# Altium schematic sheet HA_Power.SchDoc: Power supply
size A4; Date: 11/21/2016 9:12:52 PM; SheetNumber: 2; PageSetup: Record=PageOptions|CenterHorizontal=True|CenterVertical=True|PrintScale=1.02|XCorrection=1.00|YCorrection=1.00|PrintKind=0|BorderSize=5000000|LeftOffset=0|BottomOffset=0|Orientation=2|PaperLength=1000|PaperWidth=1000|Scale=100|PaperSource=257|PrintQuality=600|MediaType=1|DitherType=10|PrintScaleMode=1|PaperKind=A4 (Borderless)|PaperIndex=123
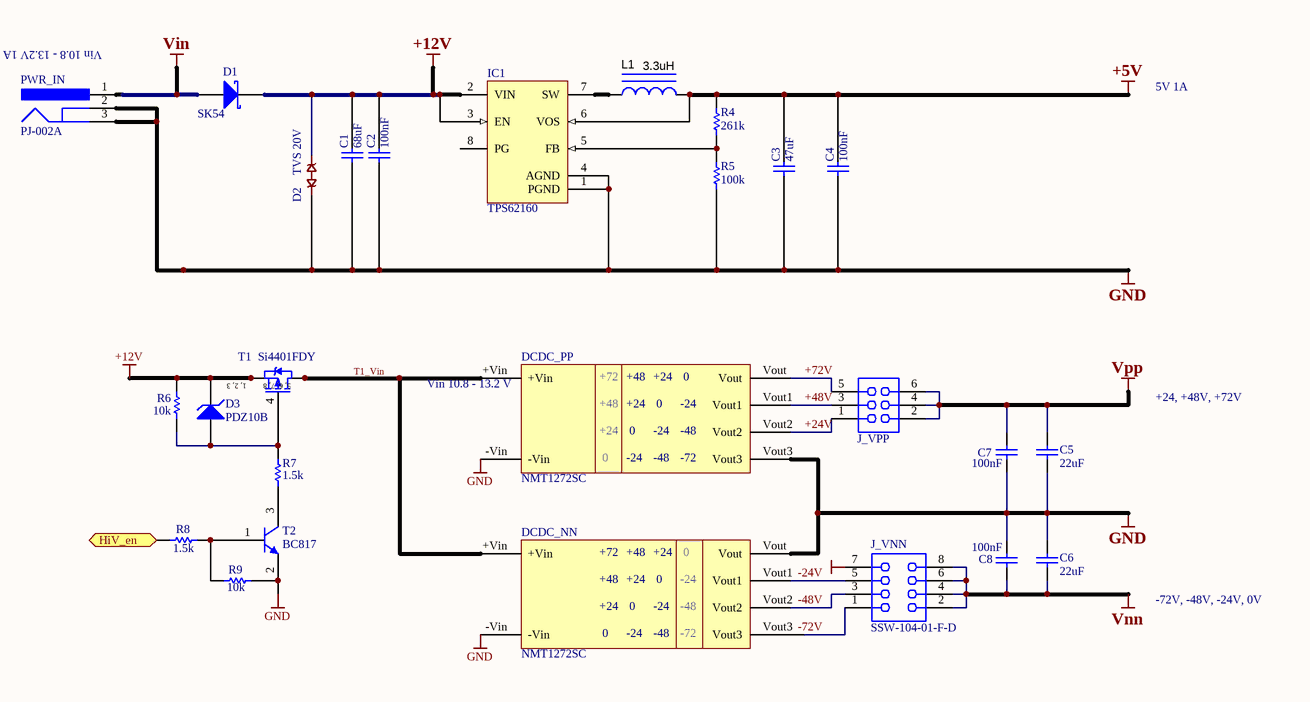
[diagram p0: HA_Power.SchDoc]

## Parts
C1  68uF  [MURA-GRM-55D_V]
C2  100nF  [CAPC0805(2012)75_N]
C3  47uF  [CAPC0805(2012)75_N]
C4  100nF  [CAPC0805(2012)75_N]
C5  22uF  [MURA-GRM-55D_V]
C6  22uF  [MURA-GRM-55D_V]
C7  100nF  [CAPC0805(2012)75_N]
C8  100nF  [CAPC0805(2012)75_N]
D1  SK54  [VISH-DO-214AC-2_V]
D2  TVS 20V  [DO214AC_BIDIR]
D3  PDZ10B  [NXP-SOD323_V]
DCDC_NN  NMT1272SC  [NMT1272SC]
DCDC_PP  NMT1272SC  [NMT1272SC]
IC1  TPS62160  [DGK8_N]
J_VNN  SSW-104-01-F-D  [SMTC-SSW-104-01-X-D]
J_VPP  SSW-103-01-F-D  [SMTC-SSW-103-01-X-D]  (value not drawn)
L1  3.3uH  [XPL2010]
PWR_IN  PJ-002A  [CUI-PJ-002A_V]
R4  261k  [RESC0805(2012)_L]
R5  100k  [RESC0805(2012)_L]
R6  10k  [RESC0805(2012)_L]
R7  1.5k  [RESC0805(2012)_L]
R8  1.5k  [RESC0805(2012)_L]
R9  10k  [RESC0805(2012)_L]
T1  Si4401FDY  [SO08]
T2  BC817  [DIOD-SOT323-3_V]

## Ports
HiV_en (in)

## Nets
+5V: C3.2 C4.2 IC1.6(VOS) L1.2 R4.1
+12V: C1.2 C2.2 D1.2(K) D2.2 D3.2(K) IC1.2(VIN) IC1.3(EN) R6.1 T1.1(S) T1.2(S) T1.3(S)
GND: C1.1 C2.1 C3.1 C4.1 C5.1 C6.2 C7.1 C8.2 D2.1 DCDC_NN.-Vin DCDC_NN.Vout DCDC_PP.-Vin DCDC_PP.Vout3 IC1.1(PGND) IC1.4(AGND) J_VNN.7 PWR_IN.2 PWR_IN.3 R5.2 R9.1 T2.2(E)
Vin: D1.1(A) PWR_IN.1
Vnn: C6.1 C8.1 J_VNN.2 J_VNN.4 J_VNN.6 J_VNN.8
Vpp: C5.2 C7.2 J_VPP.2 J_VPP.4 J_VPP.6
+24V: DCDC_PP.Vout2 J_VPP.1
+48V: DCDC_PP.Vout1 J_VPP.3
+72V: DCDC_PP.Vout J_VPP.5
-24V: DCDC_NN.Vout1 J_VNN.5
-48V: DCDC_NN.Vout2 J_VNN.3
-72V: DCDC_NN.Vout3 J_VNN.1
HiV_en: R8.2 ; port HiV_en
T1_Vin: DCDC_NN.+Vin DCDC_PP.+Vin T1.5(D) T1.6(D) T1.7(D) T1.8(D)
NetD3_1: D3.1(A) R6.2 R7.2 T1.4(G)
NetIC1_5: IC1.5(FB) R4.2 R5.1
NetIC1_7: IC1.7(SW) L1.1
NetR7_1: R7.1 T2.3(C)
NetR8_1: R8.1 R9.2 T2.1(B)

Not connected (* = marked no-connect by the designer): IC1 8(PG)

## Notes on the sheet
- (near PWR_IN) Vin 10.8 - 13.2V 1A
- 5V 1A
- (near DCDC_PP) Vin 10.8 - 13.2 V
- +24, +48V, +72V
- -72V, -48V, -24V, 0V
- Title
- Size:
- Date:
- A4
- Number:
- Time:
- Revision:
- Sheet
- of
- File:
- (in symbol NMT1272SC) +72; +48; +24; 0; -24; -48; -72
- (in symbol P-MOSFET2) 1, 2, 3; 5, 6, 7, 8

## Library data of the parts
C1 = CMP-0817-00001-1: MPN: KRM55WR71E686MH01L; Manufacturer: Murata; Height Dimension: 2.0 mm; Value: 68uF
C2 = CMP-1036-00417-1: Case-EIA: 0805; Tolerance: ±10%; Case-Metric: 2012; Rated Voltage: 50 V; Technology: SMT; Max Thickness: 0.75 mm; Value: 100nF
C3 = CMP-1036-00417-1: PartNumber: GRM21BR61A476ME15L; Case-EIA: 0805; Tolerance: ±10%; Case-Metric: 2012; Rated Voltage: 10 V; Technology: SMT; Max Thickness: 0.75 mm; Value: 47uF
C4 = CMP-1036-00417-1: Case-EIA: 0805; Tolerance: ±10%; Case-Metric: 2012; Rated Voltage: 10 V; Technology: SMT; Max Thickness: 0.75 mm; Value: 100nF
C5 C6 = CMP-0817-00001-1: MPN: KRM55WR72A226MH01L; Manufacturer: Murata; Rated Voltage: 100 V; Value: 22uF
C7 C8 = CMP-1036-00417-1: Case-EIA: 0805; Tolerance: ±10%; Case-Metric: 2012; Value: 100nF 100V; Rated Voltage: 100 V; Technology: SMT; Max Thickness: 0.75 mm
D1 = CMP-0549-00004-1: Schottky Barrier Rectifier, 40 V Maximum DC Blocking Voltage, -65 to 125 degC, 2-Pin SMA Case, RoHS; Manufacturer: Micro commercial co; MPN: SK54A-LTP; Package: SMA DO-214AC; Value: SK54
D2 = DIODE_BIDIR-DO214AC: Manufacturer: Bourns; Value: SMAJ20CA; MPN: SMAJ20CA
D3 = CMP-2000-06888-1: Zener diode; Manufacturer: NXP; Value: PDZ10B; MPN: PDZ10B
DCDC_NN DCDC_PP = NMT1272SC: pin to pad: +Vin>1 -Vin>2 Vout>5 Vout1>6 Vout2>7 Vout3>8; Manufacturer: Murata; MPN: NMT1272SC; Value: NMT1272SC
IC1 = CMP-0323-00440-1: Buck Step Down Regulator with 3 to 17 V Input and 0.9 to 6 V Output, -40 to 85 degC, 8-Pin VSOP (DGK), Green (RoHS & no Sb/Br); Manufacturer: Texas Instruments; MPN: TPS62160DGKR; PackageReference: DGK8; Value: TPS62160
J_VNN = CMP-1023-00336-1: SQ Post Socket, Through-hole, Vertical, -55 to 125 degC, 2.54mm Pitch, 8-Pin, Female, RoHS; Manufacturer: Samtec; ComponentLink2Description: Datasheet; ComponentLink1Description: Manufacturer URL; ComponentLink2URL: http://www.samtec.com/documents/webfiles/pdf/SSW_TH.PDF; ComponentLink1URL: http://www.samtec.com; Pitch: 2.54 mm; ComponentLink3Description: Package Specification; PackageReference: SSW-104-01-X-D; RoHS: True; PackageVersion: CA, 6/1987; DatasheetVersion: F-214; ComponentLink3URL: http://www.samtec.com/documents/webfiles/cpdf/SSW-1XX-XX-XXX-X-XX-XXX-XX-MKT.pdf; Mounting Technology: Through-hole; Temperature Range: -55 to 125 degC; Orientation: Vertical; PartNumber: SSW-104-01-F-D; PackageDescription: Assembly, Socket Strip .016 X .031 Tail
J_VPP = CMP-1023-00329-1: SQ Post Socket, Through-hole, Vertical, -55 to 125 degC, 2.54 mm Pitch, 6-Pin, Female, RoHS; Manufacturer: Samtec; Pitch: 2.54 mm; Temperature Range: -55 to 125 degC; ComponentLink3URL: http://www.samtec.com/documents/webfiles/cpdf/SSW-1XX-XX-XXX-X-XX-XXX-XX-MKT.pdf; ComponentLink1URL: http://www.samtec.com; Orientation: Vertical; PackageReference: SSW-103-01-X-D; RoHS: True; ComponentLink1Description: Manufacturer URL; PartNumber: SSW-103-01-F-D; PackageVersion: CA, 6/1987; ComponentLink2URL: http://www.samtec.com/documents/webfiles/pdf/SSW_TH.PDF; ComponentLink3Description: Package Specification; Mounting Technology: Through-hole; PackageDescription: Assembly, Socket Strip .016 X .031 Tail; DatasheetVersion: F-214; ComponentLink2Description: Datasheet
L1 = XPL2010-332MLB: XPL2010 Inductor; Manufacturer: Coilcraft; Value: 3.3uH; MPN: XPL2010-332MLB; PackageReference: XPL2010
PWR_IN = CMP-2000-06895-1: Through Hole Right Angle DC Power Jack, 2.5 A, 2 mm Center Pin, 3 Position, -25 to 85 degC, RoHS, Bulk; Manufacturer: CUIInc.; Current Rating: 2.5A; Inside Contact Diameter: 2mm; Insulation Resistance: 50MOhms; Outside Contact Diameter: 6.5mm; Voltage Rating: 24V; Brand: CUI; Operating Temperature Range: -25Cto+85C; Mounting Technology: ThroughHole; Connector Type: DCPowerJack; Contact Material: Copper; Datasheet URL: http://www.cui.com/product/resource/pj-002a.pdf; Contact Gender: Male; Housing Material: PolybutyleneTerephthalate(PBT); Manufacturer URL: http://www.cui.com/; Package Reference: PJ-002A; Mounting Style: ThroughHole; Mounting Angle: Right; Product Category: DCPowerConnectors; Product: Jacks; Flammability Rating: UL94V-0; Contact Plating: Nickel; RoHS: True; Datasheet Version: Rev. 1.03, 04/2016; Package Description: 3-Pin Through Hole Device, Body 14.4 x 9 mm, Height 11 mm; Factory Pack Quantity: 500; Termination Style: ThroughHole
R4-R9 = CMP-1013-00429-1: 0.125W 1% 0805 (2012 Metric)  SMD; Case-EIA: 0805; Case-Metric: 2012; Technology: SMT; Power: 0.125 W; Tolerance: 1 %
  R4: Value: 261k
  R5: Value: 100k
  R6 R9: Value: 10k
  R7 R8: Value: 1.5k
T1 = P-MOSFET2: HEXFET Power MOSFET; Value: Si4401FDY; MPN: Si4401FDY
T2 = CMP-2000-05934-1: NPN Small Signal Transistor, 45 V, 500 mA; Manufacturer: DiodesIncorporated; MPN: BC817-40W-7; Package / Case: SOT-23; Transistor Polarity: NPN; Package Reference: SOT323; Value: BC817